# Altium schematic sheet LED_SOP.SchDoc
size A
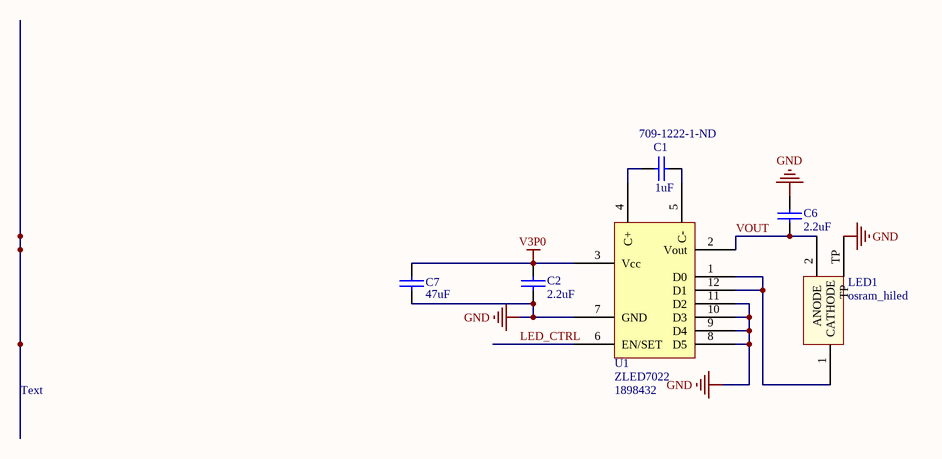
[diagram p0: LED_SOP.SchDoc]

## Parts
C1  value 1uF  Supplier Part Number 1: 709-1222-1-ND  [0402s]  (hidden comment: NP0 50V)
C2  value 2.2uF  [0402s]  (hidden comment: NP0 50V)
C6  value 2.2uF  [0402s]  (hidden comment: NP0 50V)
C7  value 47uF  [0402s]  (hidden comment: NP0 50V)
LED1  osram_hiled  [LUXEON LED]
U1  ZLED7022  Supplier Part Number 1: 1898432  [12utqfn]

## Nets
GND: C2.1 C6.2 C7.1 LED1.TP U1.7(GND) U1.8(D5) U1.9(D4) U1.10(D3) U1.11(D2)
V3P0: C2.2 C7.2 U1.3(Vcc)
LED_CTRL: U1.6(EN/SET)
VOUT: C6.1 LED1.2(ANODE) U1.2(Vout)
NetC1_1: C1.1 U1.4(C+)
NetC1_2: C1.2 U1.5(C-)
NetLED1_1: LED1.1(CATHODE) U1.1(D0) U1.12(D1)

## Notes on the sheet
- Text

## Library data of the parts
C1 = Cap: Capacitor; Part Field 1: 0402; Manufacturer: Johanson Dielectrics Inc; Manufacturer Part Number: 100R07X105KV4T; Description: CAP CER 1UF 10V X5R 0402; Capacitance: 1.0µF; Voltage - Rated: 10V; Tolerance: ±10%; Temperature Coefficient: X5R; Supplier 1: Digi-Key; RoHS: RoHS Compliant; Category: Capacitors; Stock 1: 22620; Pricing 1: 10=0.146, 100=0.0861, 500=0.04968, 1000=0.03445 (USD); Mounting Type: Surface Mount, MLCC; Operating Temperature: -55°C ~ 85°C; Applications: SMPS Filtering; Ratings: -; Package / Case: 0402 (1005 Metric); Size / Dimension: 0.040" L x 0.020" W (1.02mm x 0.51mm); Height: -; Thickness: 0.025" (0.64mm); Lead Spacing: -; Features: -; Packaging: Cut Tape (CT); Lead Style: -; ComponentLink1URL: http://www.johansondielectrics.com/images/stories/surface-mount/tanceram/JDI_Tanceram_2010-03.pdf; ComponentLink1Description: http://www.johansondielectrics.com/images/stories/surface-mount/tanceram/JDI_Tanceram_2010-03.pdf
C2 C6 C7 = Cap: Capacitor; Part Field 1: 0402
U1 = ZLED7022: ZLED 7022; Manufacturer: ZMDI; Manufacturer Part Number: ZLED7022-ZI1R; Description: ZMDI - ZLED7022-ZI1R - LED DRIVER, 6CH, 20MA, UTQFN12; LED Driver Application: Cell Phones, PDA; No. of Outputs: 1; Output Current: 20; Input Voltage: 2.8V to 5.5; Driver Case Style: UTQFN; No. of Pins: 12; Supplier 1: Farnell; RoHS: YES; Category: Semiconductors - ICs; Stock 1: 99; Pricing 1: 1=1.39, 10=0.99, 100=0.77, 250=0.7, 500=0.58 (GBP); Operating Temperature Range: -40°C to +85; Switching Frequency: 1; ComponentLink1URL: http://www.zmdi.com/products/led-drivers/zled7022/; ComponentLink1Description: http://www.zmdi.com/products/led-drivers/zled7022/; ComponentLink2URL: http://www.farnell.com/datasheets/1340041.pdf; ComponentLink2Description: http://www.farnell.com/datasheets/1340041.pdf